# Altium project Displaid_Sensor_v1.PrjPcb
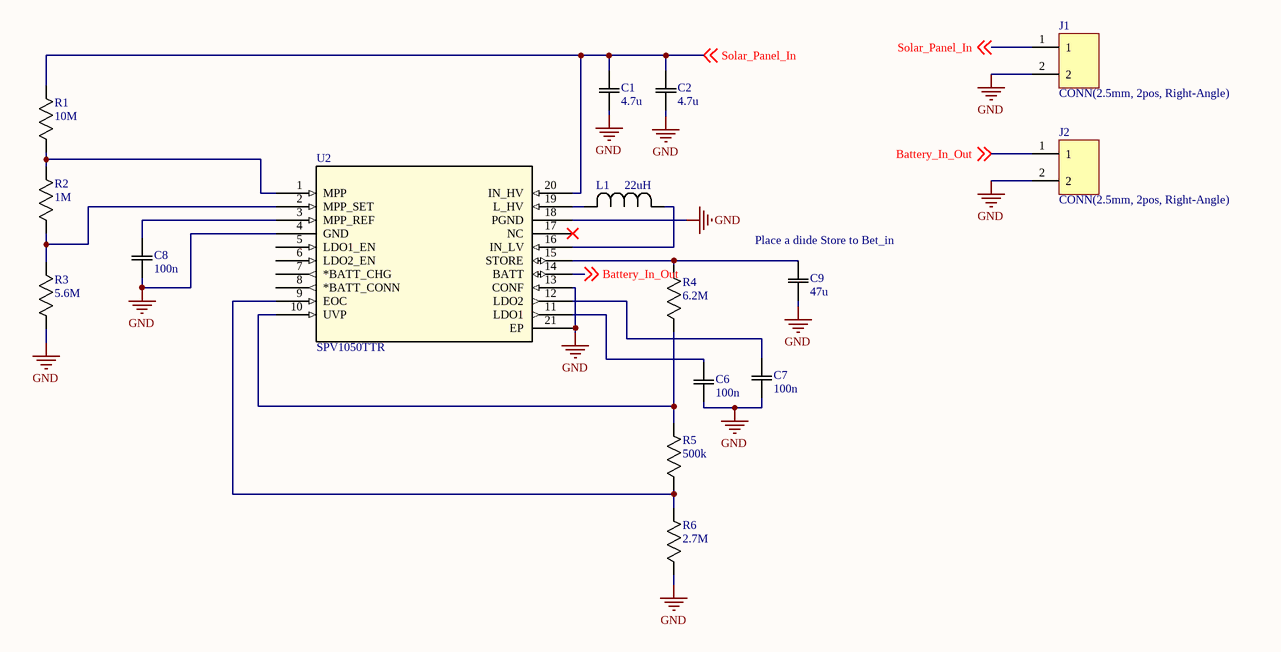
[diagram p0: Power Harvesting.SchDoc]
3 sheets, 39 parts. Net scope: global (net labels, ports and power ports of the same name join across sheets).
Board file: Displaid_Sensor_v1.PcbDoc
Sheets:
  Power Harvesting.SchDoc
  Accelerometer.SchDoc
  GPS Module.SchDoc

## Sheet Power Harvesting.SchDoc
size A4; SheetNumber: 1; SheetTotal: 3

### Parts
C1  4.7u  [CAPC220145_100N_KEM]
C2  4.7u  [CAPC220145_100N_KEM]
C6  100n  [YAG_CC0603_YAG]
C7  100n  [YAG_CC0603_YAG]
C8  100n  [YAG_CC0603_YAG]
C9  47u  [CAPC220145_100N_KEM]
J1  CONN(2.5mm, 2pos, Right-Angle)  [CONN_S2B-PH-K-S_JST]
J2  CONN(2.5mm, 2pos, Right-Angle)  [CONN_S2B-PH-K-S_JST]
L1  22uH  [IND_LPS4018-103MLB_COC]
R1  10M  [RES_CRCW_0805_VIS]
R2  1M  [RES_CRCW_0805_VIS]
R3  5.6M  [RES_CRCW_0805_VIS]
R4  6.2M  [RES_CRCW_0805_VIS]
R5  500k  [RES_CRCW_0805_VIS]
R6  2.7M  [RES_CRCW_0805_VIS]
U2  SPV1050TTR  [VFQFPN20_3X3_STM]

### Nets
GND: C1.2 C2.2 C6.1 C7.1 C8.1 C9.2 J1.2 J2.2 R3.1 R6.1 U2.4(GND) U2.13(CONF) U2.18(PGND) U2.21(EP)
Battery_In_Out: J2.1 U2.14(BATT) ; off-sheet Battery_In_Out
Solar_Panel_In: C1.1 C2.1 J1.1 R1.2 U2.20(IN_HV) ; off-sheet Solar_Panel_In
NetC6_2: C6.2 U2.11(LDO1)
NetC7_2: C7.2 U2.12(LDO2)
NetC8_2: C8.2 U2.3(MPP_REF)
NetC9_1: C9.1 R4.2 U2.15(STORE)
NetL1_1: L1.1 U2.16(IN_LV)
NetL1_2: L1.2 U2.19(L_HV)
NetR1_1: R1.1 R2.2 U2.1(MPP)
NetR2_1: R2.1 R3.2 U2.2(MPP_SET)
NetR4_1: R4.1 R5.2 U2.10(UVP)
NetR5_1: R5.1 R6.2 U2.9(EOC)

Not connected (* = marked no-connect by the designer): U2 5(LDO1_EN) 6(LDO2_EN) 7(*BATT_CHG) 8(*BATT_CONN) 17(NC)*

### Notes on the sheet
- (near C9) Place a diıde Store to Bet_in

### Library data of the parts
C1 C2 C9 = C0805C105Z4VACTU: SMD-805; Mfr_Name: Kemet; Type: DEV; Copyright: Copyright (C) 2023 Ultra Librarian. All rights reserved.; Manufacturer_Part_Number: C0805C105Z4VACTU; RefDes: RefDes
C6-C8 = CC0603KRX7R8BB104: No Description Available; Mfr_Name: Yageo; Type: DEV; Copyright: Copyright (C) 2024 Ultra Librarian. All rights reserved.; Manufacturer_Part_Number: CC0603KRX7R8BB104; RefDes: RefDes
J1 J2 = CONN(2.5mm, 2pos, Right-Angle): No Description Available; Mfr_Name: JST; RefDes: RefDes; Type: Type
L1 = LPS4018-103MLB: No Description Available; Mfr_Name: Coilcraft; Type: DEV; Copyright: Copyright (C) 2024 Ultra Librarian. All rights reserved.; Manufacturer_Part_Number: LPS4018-103MLB; RefDes: RefDes
R1 = CRCW0805100KJNEAC: 10K; Mfr_Name: Vishay; Copyright: Copyright (C) 2023 Ultra Librarian. All rights reserved.; Manufacturer_Part_Number: CRCW0805100KJNEAC; RefDes: RefDes; Type: DEV
R2-R6 = CRCW0805100KJNEAC: No Description Available; Mfr_Name: Vishay; Copyright: Copyright (C) 2023 Ultra Librarian. All rights reserved.; Manufacturer_Part_Number: CRCW0805100KJNEAC; RefDes: RefDes; Type: DEV
U2 = SPV1050TTR: No Description Available; Mfr_Name: STMicroelectronics; Copyright: Copyright (C) 2024 Ultra Librarian. All rights reserved.; Manufacturer_Part_Number: SPV1050TTR; RefDes: RefDes; Type: DEV

## Sheet Accelerometer.SchDoc
size A4; SheetNumber: 2; SheetTotal: 3
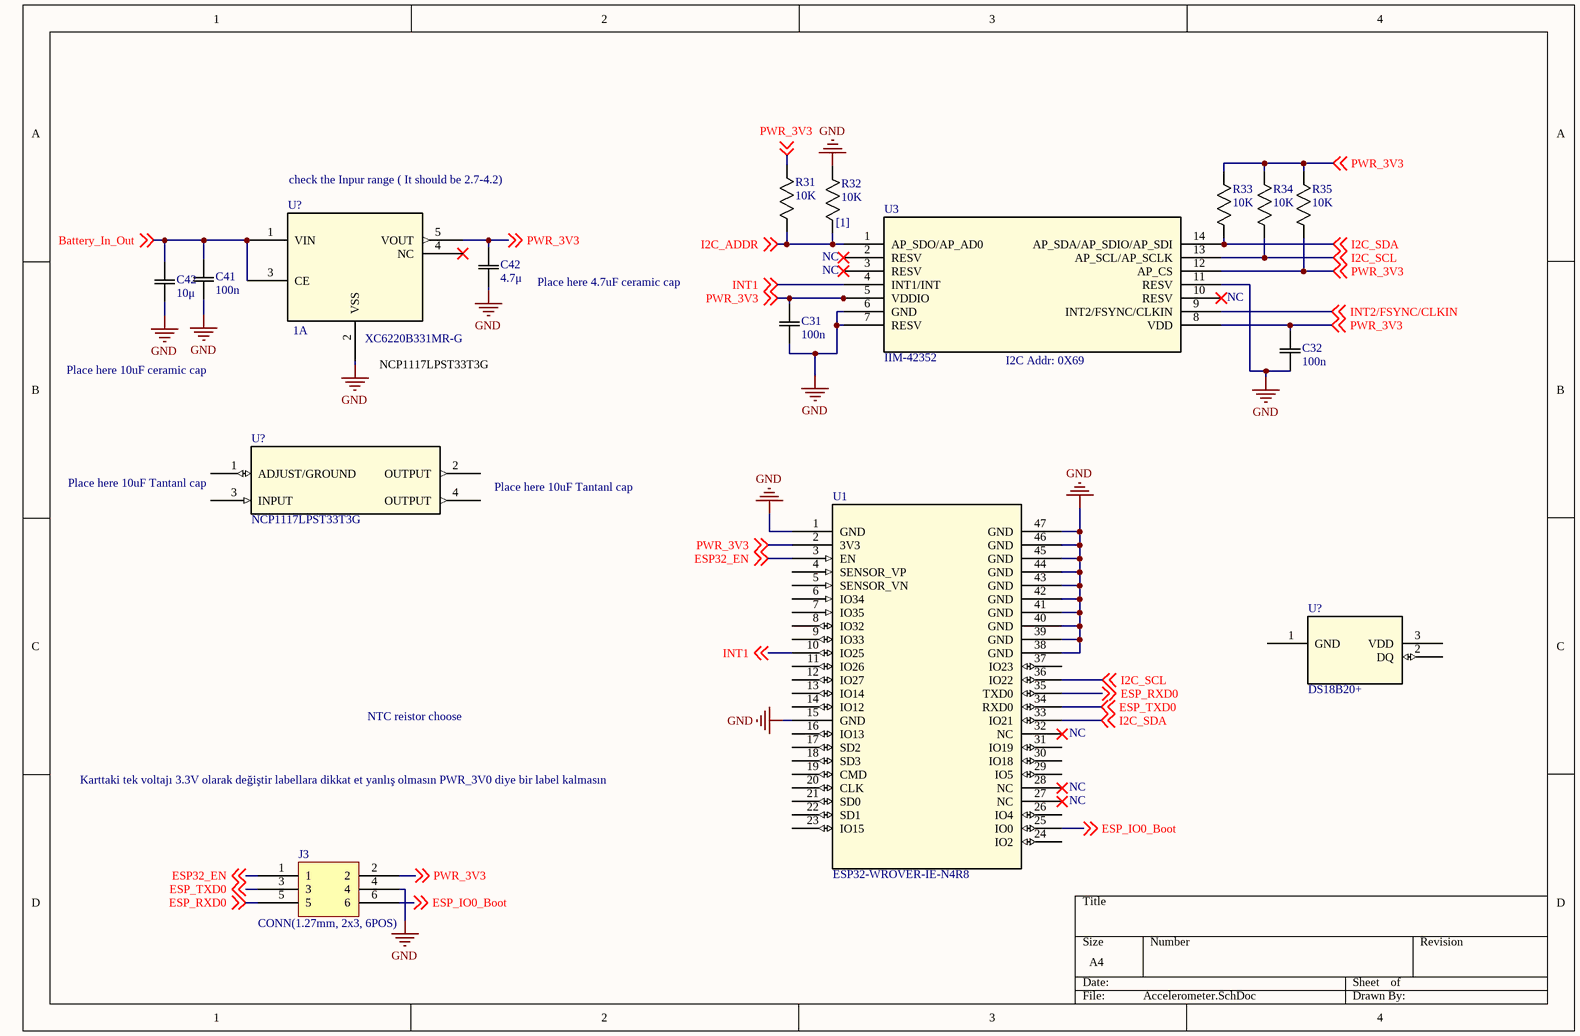
[diagram p1: Accelerometer.SchDoc]

### Parts
(Parts that share a designator on the sheet are numbered #1, #2 ... from top to bottom, then left to right.)
C31  100n  [YAG_CC0603_YAG]
C32  100n  [YAG_CC0603_YAG]
C41  100n  [YAG_CC0603_YAG]
C42#1  4.7μ  [CAPC220145_100N_KEM]
C42#2  10μ  [CAPC220145_100N_KEM]
J3  CONN(1.27mm, 2x3, 6POS)  [SAMTEC_SHF-103-01-L-D-SM]
R31  10K  [RC0603N_VIS]
R32  10K  [RC0603N_VIS]
R33  10K  [RC0603N_VIS]
R34  10K  [RC0603N_VIS]
R35  10K  [RC0603N_VIS]
U1  ESP32-WROVER-IE-N4R8  [ESP32-WROVER-IB_EXP]
U3  IIM-42352  [IIM-42652_TDK]
U?#1  XC6220B331MR-G  [SOT-25_TOR]
U?#2  NCP1117LPST33T3G  [SOT223-3_ONS]
U?#3  DS18B20+  [21-0248A_Q3-1_MXM]

### Nets
GND: C31.1 C32.1 C41.1 C42#1.2 C42#2.2 J3.4 R32.1 U1.1(GND) U1.15(GND) U1.38(GND) U1.39(GND) U1.40(GND) U1.41(GND) U1.42(GND) U1.43(GND) U1.44(GND) U1.45(GND) U1.46(GND) U1.47(GND) U3.6(GND) U3.7(RESV) U3.11(RESV) U?#1.2(VSS)
Battery_In_Out: C41.2 C42#2.1 U?#1.1(VIN) U?#1.3(CE) ; off-sheet Battery_In_Out
ESP32_EN: J3.1 U1.3(EN) ; off-sheet ESP32_EN
ESP_IO0_Boot: J3.6 U1.25(IO0) ; off-sheet ESP_IO0_Boot
ESP_RXD0: J3.5 U1.35(TXD0) ; off-sheet ESP_RXD0
ESP_TXD0: J3.3 U1.34(RXD0) ; off-sheet ESP_TXD0
I2C_ADDR: R31.2 R32.2 U3.1(AP_SDO/AP_AD0) ; off-sheet I2C_ADDR
I2C_SCL: R34.2 U1.36(IO22) U3.13(AP_SCL/AP_SCLK) ; off-sheet I2C_SCL
I2C_SDA: R33.2 U1.33(IO21) U3.14(AP_SDA/AP_SDIO/AP_SDI) ; off-sheet I2C_SDA
INT1: U1.10(IO25) U3.4(INT1/INT) ; off-sheet INT1
INT2/FSYNC/CLKIN: U3.9(INT2/FSYNC/CLKIN) ; off-sheet INT2/FSYNC/CLKIN
PWR_3V3: C31.2 C32.2 C42#1.1 J3.2 R31.1 R33.1 R34.1 R35.1 R35.2 U1.2(3V3) U3.5(VDDIO) U3.8(VDD) U3.12(AP_CS) U?#1.5(VOUT) ; off-sheet PWR_3V3

Not connected (* = marked no-connect by the designer): U1 4(SENSOR_VP) 5(SENSOR_VN) 6(IO34) 7(IO35) 8(IO32) 9(IO33) 11(IO26) 12(IO27) 13(IO14) 14(IO12) 16(IO13) 17(SD2) 18(SD3) 19(CMD) 20(CLK) 21(SD0) 22(SD1) 23(IO15) 24(IO2) 26(IO4) 27(NC)* 28(NC)* 29(IO5) 30(IO18) 31(IO19) 32(NC)* 37(IO23); U3 2(RESV)* 3(RESV)* 10(RESV)*; U?#1 4(NC)*; U?#2 1(ADJUST/GROUND) 2(OUTPUT) 3(INPUT) 4(OUTPUT); U?#3 1(GND) 2(DQ) 3(VDD)

### Notes on the sheet
- check the Inpur range ( It should be 2.7-4.2)
- (near R32) [1]
- (near C42#1) Place here 4.7uF ceramic cap
- NC
- Place here 10uF ceramic cap
- (near U?#1) 1A
- (near U?#1) NCP1117LPST33T3G
- (near U3) I2C Addr: 0X69
- (near U?#2) Place here 10uF Tantanl cap
- Place here 10uF Tantanl cap
- NTC reistor choose
- Karttaki tek voltajı 3.3V olarak değiştir labellara dikkat et yanlış olmasın PWR_3V0 diye bir label kalmasın
- (near U1) NC

### Library data of the parts
C31 C32 C41 = CC0603KRX7R8BB104: as C6 on sheet Power Harvesting; Copyright: Copyright (C) 2024 Ultra Librarian. All rights reserved.; Manufacturer_Part_Number: CC0603KRX7R8BB104; RefDes: RefDes
C42#1 C42#2 = C0805C105Z4VACTU: No Description Available; Mfr_Name: Kemet; Type: DEV; Copyright: Copyright (C) 2023 Ultra Librarian. All rights reserved.; Manufacturer_Part_Number: C0805C105Z4VACTU; RefDes: RefDes
J3 = SHF-103-01-L-D-SM: Connector Header Surface Mount 6 position 0.050 (1.27mm); MF: Samtec; SnapEDA_Link: https://www.snapeda.com/parts/SHF-103-01-L-D-SM/Samtec/view-part/3351308/?ref=snap; Purchase-URL: https://pricing.snapeda.com/search/part/SHF-103-01-L-D-SM/?ref=eda; Digi-Key_Part_Number: SHF-103-01-L-D-SM-LC-ND; Check_prices: https://www.snapeda.com/parts/SHF-103-01-L-D-SM/Samtec/view-part/3351308/?ref=eda; Value: *; Package: None; MP: SHF-103-01-L-D-SM
R31-R35 = RES(10K, SMD-603): Mfr_Name: Vishay
U1 = ESP32-WROVER-B-N4R8: Mfr_Name: Espressif Systems; Type: RF; RefDes: RefDes
U3 = IIM-42352: No Description Available; Mfr_Name: TDK; RefDes: RefDes; Type: Type
U?#1 = XC6220B331MR-G: No Description Available; Mfr_Name: Torex Semiconductor; RefDes: RefDes; Type: Type
U?#2 = NCP1117LPST33T3G: No Description Available; Mfr_Name: onsemi; RefDes: RefDes; Type: Type
U?#3 = DS18B20+: No Description Available; Mfr_Name: Analog Devices / Maxim Integrated; RefDes: RefDes; Type: Type

## Sheet GPS Module.SchDoc
size A4; SheetNumber: 3; SheetTotal: 3
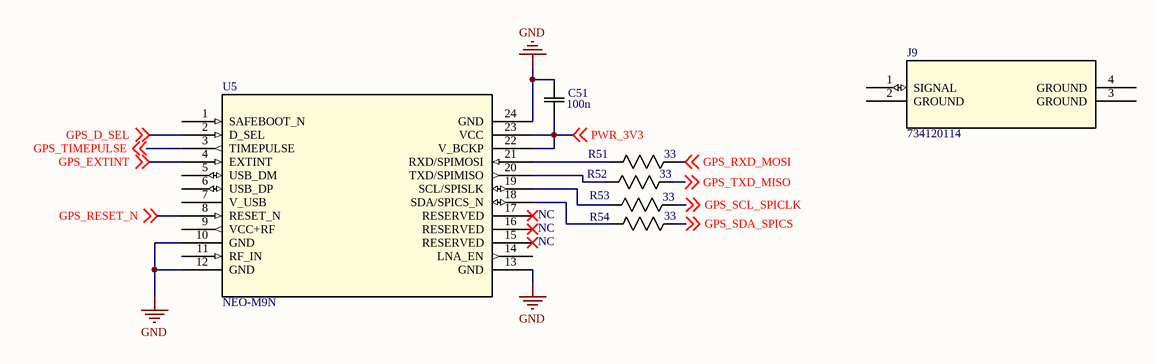
[diagram p2: GPS Module.SchDoc]

### Parts
C51  100n  [YAG_CC0603_YAG]
J9  734120114  [73412-0114_MOL]
R51  33  [RC0603N_VIS]
R52  33  [RC0603N_VIS]
R53  33  [RC0603N_VIS]
R54  33  [RC0603N_VIS]
U5  NEO-M9N  [NEO-M9N_UBL]

### Nets
GND: C51.2 U5.10(GND) U5.12(GND) U5.13(GND) U5.24(GND)
GPS_D_SEL: U5.2(D_SEL) ; off-sheet GPS_D_SEL
GPS_EXTINT: U5.4(EXTINT) ; off-sheet GPS_EXTINT
GPS_RESET_N: U5.8(RESET_N) ; off-sheet GPS_RESET_N
GPS_RXD_MOSI: R51.2 ; off-sheet GPS_RXD_MOSI
GPS_SCL_SPICLK: R53.2 ; off-sheet GPS_SCL_SPICLK
GPS_SDA_SPICS: R54.2 ; off-sheet GPS_SDA_SPICS
GPS_TIMEPULSE: U5.3(TIMEPULSE) ; off-sheet GPS_TIMEPULSE
GPS_TXD_MISO: R52.2 ; off-sheet GPS_TXD_MISO
PWR_3V3: C51.1 U5.22(V_BCKP) U5.23(VCC) ; off-sheet PWR_3V3
NetR51_1: R51.1 U5.21(RXD/SPIMOSI)
NetR52_1: R52.1 U5.20(TXD/SPIMISO)
NetR53_1: R53.1 U5.19(SCL/SPISLK)
NetR54_1: R54.1 U5.18(SDA/SPICS_N)

Not connected (* = marked no-connect by the designer): J9 1(SIGNAL) 2(GROUND) 3(GROUND) 4(GROUND); U5 1(SAFEBOOT_N) 5(USB_DM) 6(USB_DP) 7(V_USB) 9(VCC+RF) 11(RF_IN) 14(LNA_EN) 15(RESERVED)* 16(RESERVED)* 17(RESERVED)*

### Notes on the sheet
- NC
- (near U5) NC

### Library data of the parts
C51 = CC0603KRX7R8BB104: as C6 on sheet Power Harvesting; Copyright: Copyright (C) 2024 Ultra Librarian. All rights reserved.; Manufacturer_Part_Number: CC0603KRX7R8BB104; RefDes: RefDes
J9 = 734120114: No Description Available; Mfr_Name: Molex Connector Corporation; RefDes: RefDes; Type: Type
R51-R54 = RES(10K, SMD-603): Mfr_Name: Vishay
U5 = NEO-M9N: No Description Available; Mfr_Name: Ublox; RefDes: RefDes; Type: Type

## Nets that join several sheets
GND: Power Harvesting (14 pins), Accelerometer (23 pins), GPS Module (5 pins)
Battery_In_Out: Power Harvesting (J2.1 U2.14), Accelerometer (C41.2 C42#2.1 U?#1.1 U?#1.3)
PWR_3V3: Accelerometer (14 pins), GPS Module (C51.1 U5.22 U5.23)